# EAGLE design Intar_Button_Module (EAGLE 7.3.0)
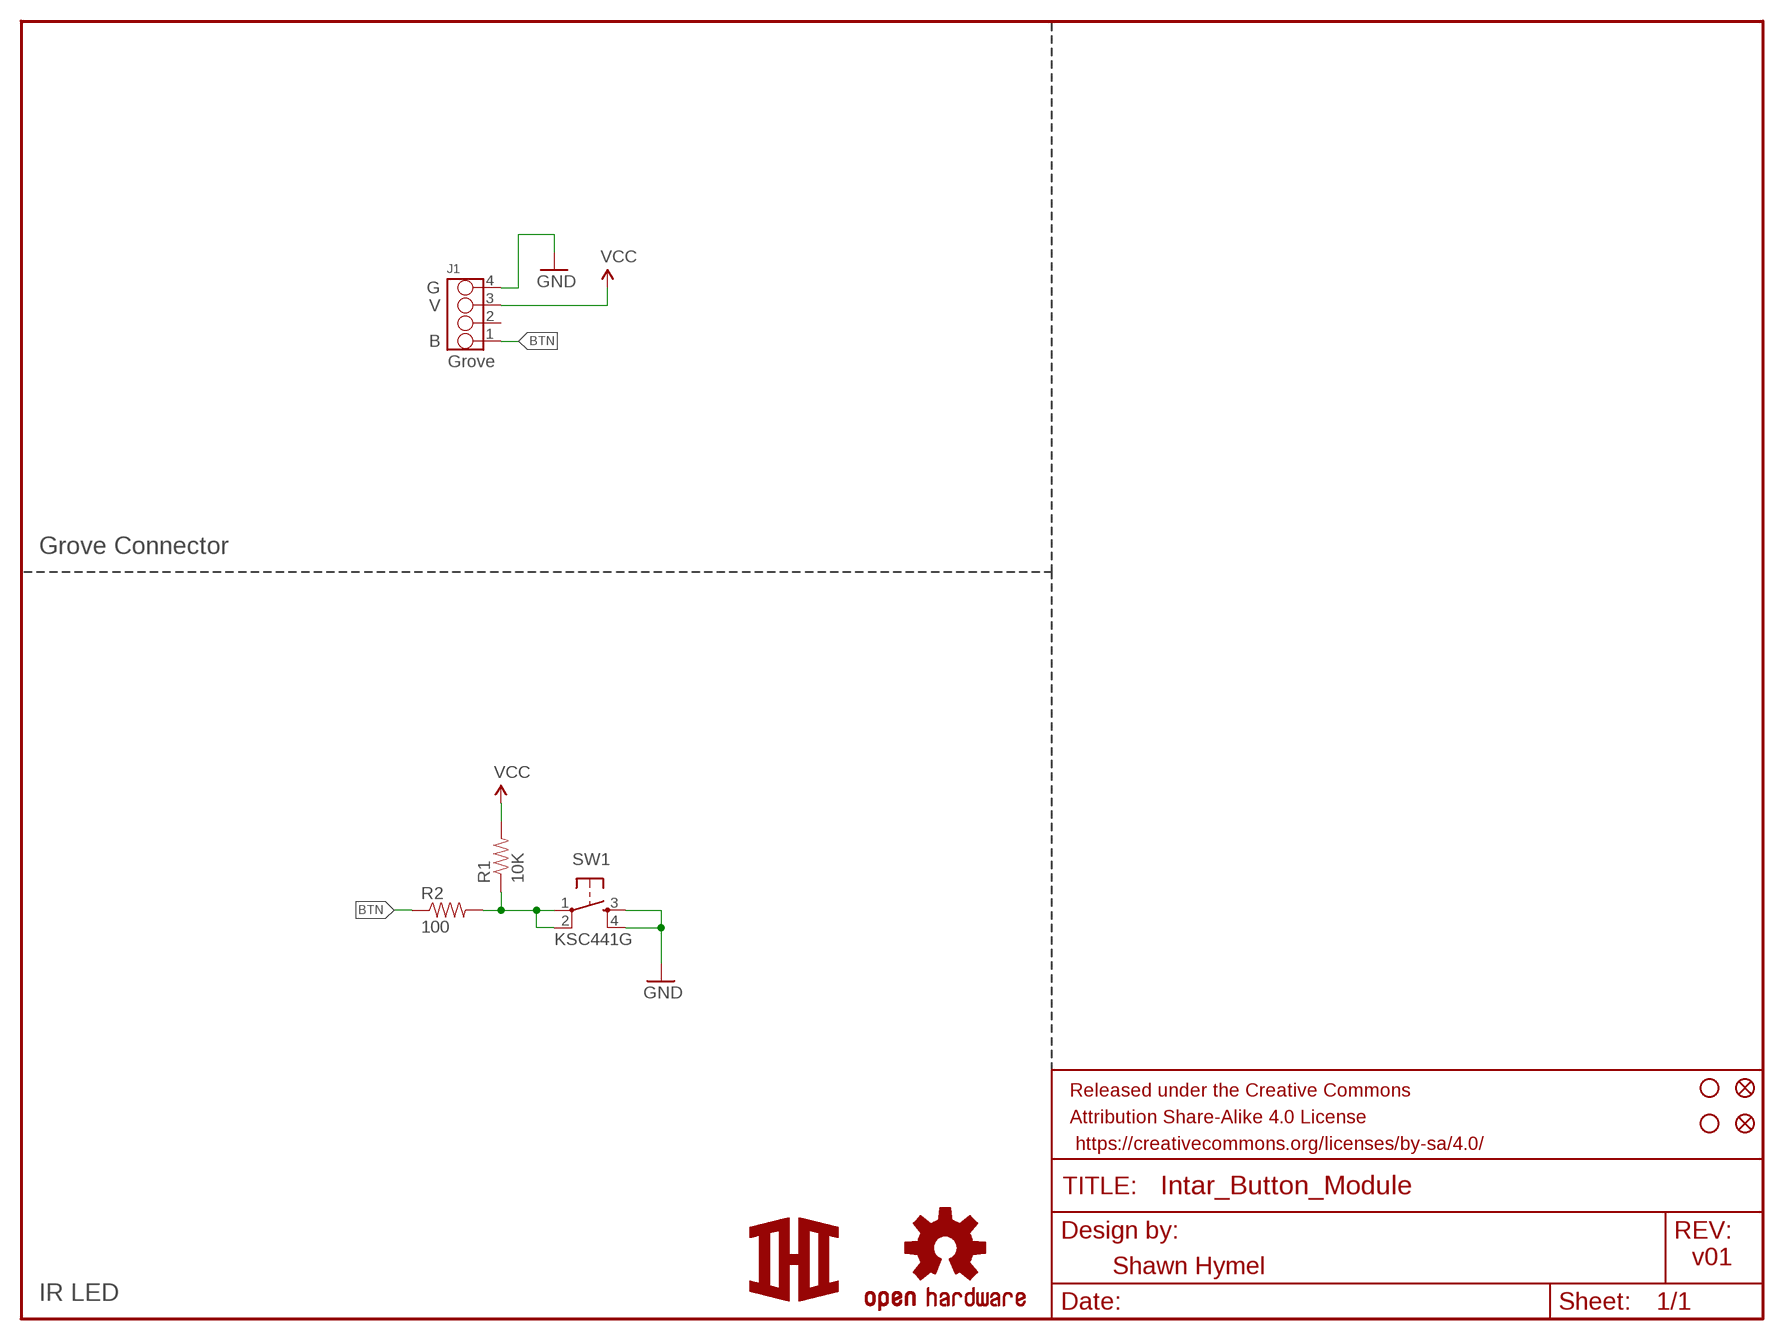
[diagram p0: schematic, sheet 1]

## Parts
FID1  FIDUCIAL1X2  [FIDUCIAL-1X2]
FID2  FIDUCIAL1X2  [FIDUCIAL-1X2]
FRAME1  FRAME-LETTER  [CREATIVE_COMMONS]
J1  GROVE-4P-2.0-3470130P1  [4P-2.0]
LOGO1  OSHW-LOGOS  [OSHW-LOGO-S]
R1  10K  10KOHM-1/10W-1%(0603)0603  [0603-RES]
R2  100  100OHM-1/10W-1%(0603)  [0603-RES]
STANDOFF1  STAND-OFF  [STAND-OFF]
STANDOFF2  STAND-OFF  [STAND-OFF]
SW1  SWITCH_MOMENTARY  [KSCXXXG]
U$1  LOGOSM  [LOGO_SM]

## Nets
BTN: J1.1 R2.1
GND: J1.4 SW1.3 SW1.4
N$1: R1.1 R2.2 SW1.1 SW1.2
VCC: J1.3 R1.2
Unconnected: J1.2

## Notes on the sheet
- G
- V
- B
- Grove
- Grove Connector
- KSC441G
- v01
- Shawn Hymel
- IR LED

## Library data of the parts
FID1 FID2 = SparkFun-Aesthetics:FIDUCIAL: Fiducial Alignment Points Various fiducial points for machine vision alignment.
FRAME1 = SparkFun-Aesthetics:FRAME-LETTER: Schematic Frame Standard 8.5x11 US Letter frame
J1 = Connector:GROVE-4P-2.0
LOGO1 = SparkFun-Aesthetics:OSHW-LOGO: Open Source Hardware Logo This logo indicates the piece of hardware it is found on incorporates a OSHW license and/or adheres to the definition of open source hardware found here: http://freedomdefined.org/OSHW
R1 = SparkFun-Resistors:10KOHM-1/10W-1%(0603): RES-00824; PROD_ID: RES-00824
R2 = SparkFun-Resistors:100OHM-1/10W-1%(0603): RES-07863; PROD_ID: RES-07863
STANDOFF1 STANDOFF2 = SparkFun-Electromechanical:STAND-OFF: #4 Stand Off This is the mechanical footprint for a #4 phillips button head screw. Use the keepout ring to avoid running the screw head into surrounding components. SKU : PRT-00447
SW1 = Intar_Eagle_Library:SWITCH_MOMENTARY
U$1 = Intar_Eagle_Library:LOGO

## Board
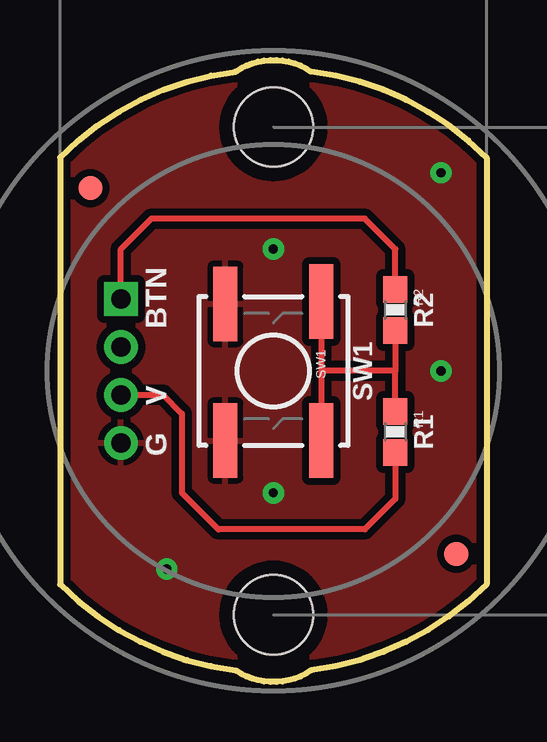
[diagram p1: board, top side]
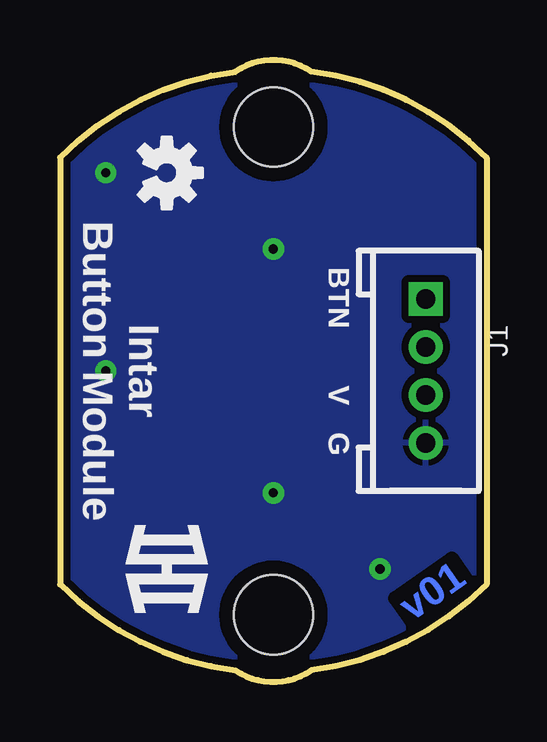
[diagram p2: board, bottom side, seen from below]

Size 17.78 x 25.91 mm. Coordinates in mm from the lower left corner, seen from the top.
Outline: 17.78,21.85 17.78,4.07 arc-38 10.46,0.48 arc-69 7.32,0.48 arc-38 0,4.07 0,21.85 arc-38 7.32,25.43 arc-69 10.46,25.43 arc-38 17.78,21.85
Copper layers (1*16): Top 0.035mm / dielectric 1.5mm / Bottom 0.035mm
Design rules "SparkFun-2-layer": minimum track width 7mil, minimum drill 15mil, track to track 8mil, track to pad 8mil, pad to pad 8mil, via to via 8mil, smd to smd 8mil, copper to edge 8mil, drill to drill 8mil, minimum pad ring 12mil, minimum via ring 10mil, stop-mask expansion 4mil, vias tented up to drill 20mil, thermal gap 10mil

### Footprints (pad centres in the part's own frame; a part is rotated, then mirrored left to right if it is on the bottom)
FIDUCIAL-1X2 = smd 1 x 1: 1 0,0
4P-2.0 = drill 0.8 pad 1.27 square: 1 -3,0 | drill 0.8 pad 1.27: 2 -1,0; 3 1,0; 4 3,0
0603-RES = smd 1.1 x 1: 1 -0.85,0; 2 0.85,0
STAND-OFF = hole 3.302: 0,0
KSCXXXG = smd 3.1 x 1: 1 -2.9,2; 2 2.9,2; 3 -2.794,-2; 4 2.9,-2

### Placement (x,y rotation side)
FID1  1.27,20.58 0 top
FID2  16.51,5.34 0 top
FRAME1  -24.13,-9.9 0 top  (outside the outline)
J1  2.54,12.96 270 bottom
LOGO1  13.34,21.21 270 bottom
R1  13.97,10.42 270 top
R2  13.97,15.5 270 top
STANDOFF1  8.89,2.8 0 top
STANDOFF2  8.89,23.12 0 top
SW1  8.89,12.96 270 top
U$1  13.34,4.7 270 bottom

### Tracks (layer width: path | path; a pad name or v marks a point on that pad's centre or on a via)
BTN
  Top 0.254: J1.1 2.54,18.04 3.81,19.31 12.7,19.31 13.97,18.04 R2.1
GND  (via drill 0.38)
  other vias: 8.89,7.88 8.89,18.04 15.88,12.96 15.88,21.21 4.45,4.7
  pour Top (isolate 0.305): 17.78,26.93 0,26.93 0,-1.01 17.78,-1.01
  pour Bottom (isolate 0.305): 0,26.93 0,-1.01 17.78,-1.01 17.78,26.93
N$1
  Top 0.254: SW1.1 10.89,12.96 | 10.89,12.96 SW1.2 | R2.2 13.97,12.96 | 13.97,12.96 10.89,12.96 | R1.1 13.97,12.96
VCC
  Top 0.254: J1.3 4.3,11.96 5.08,11.18 5.08,7.88 6.48,6.48 6.6,6.35 12.7,6.35 13.97,7.62 R1.2

### Text on the board
Bottom: v01
tPlace: BTN | R2 | SW1 | V | G | R1
bPlace: BTN | Intar / Button Module | V | G
tDocu: Shawn Hymel